# EAGLE schematic Schematic v28 (EAGLE 9.7.0)
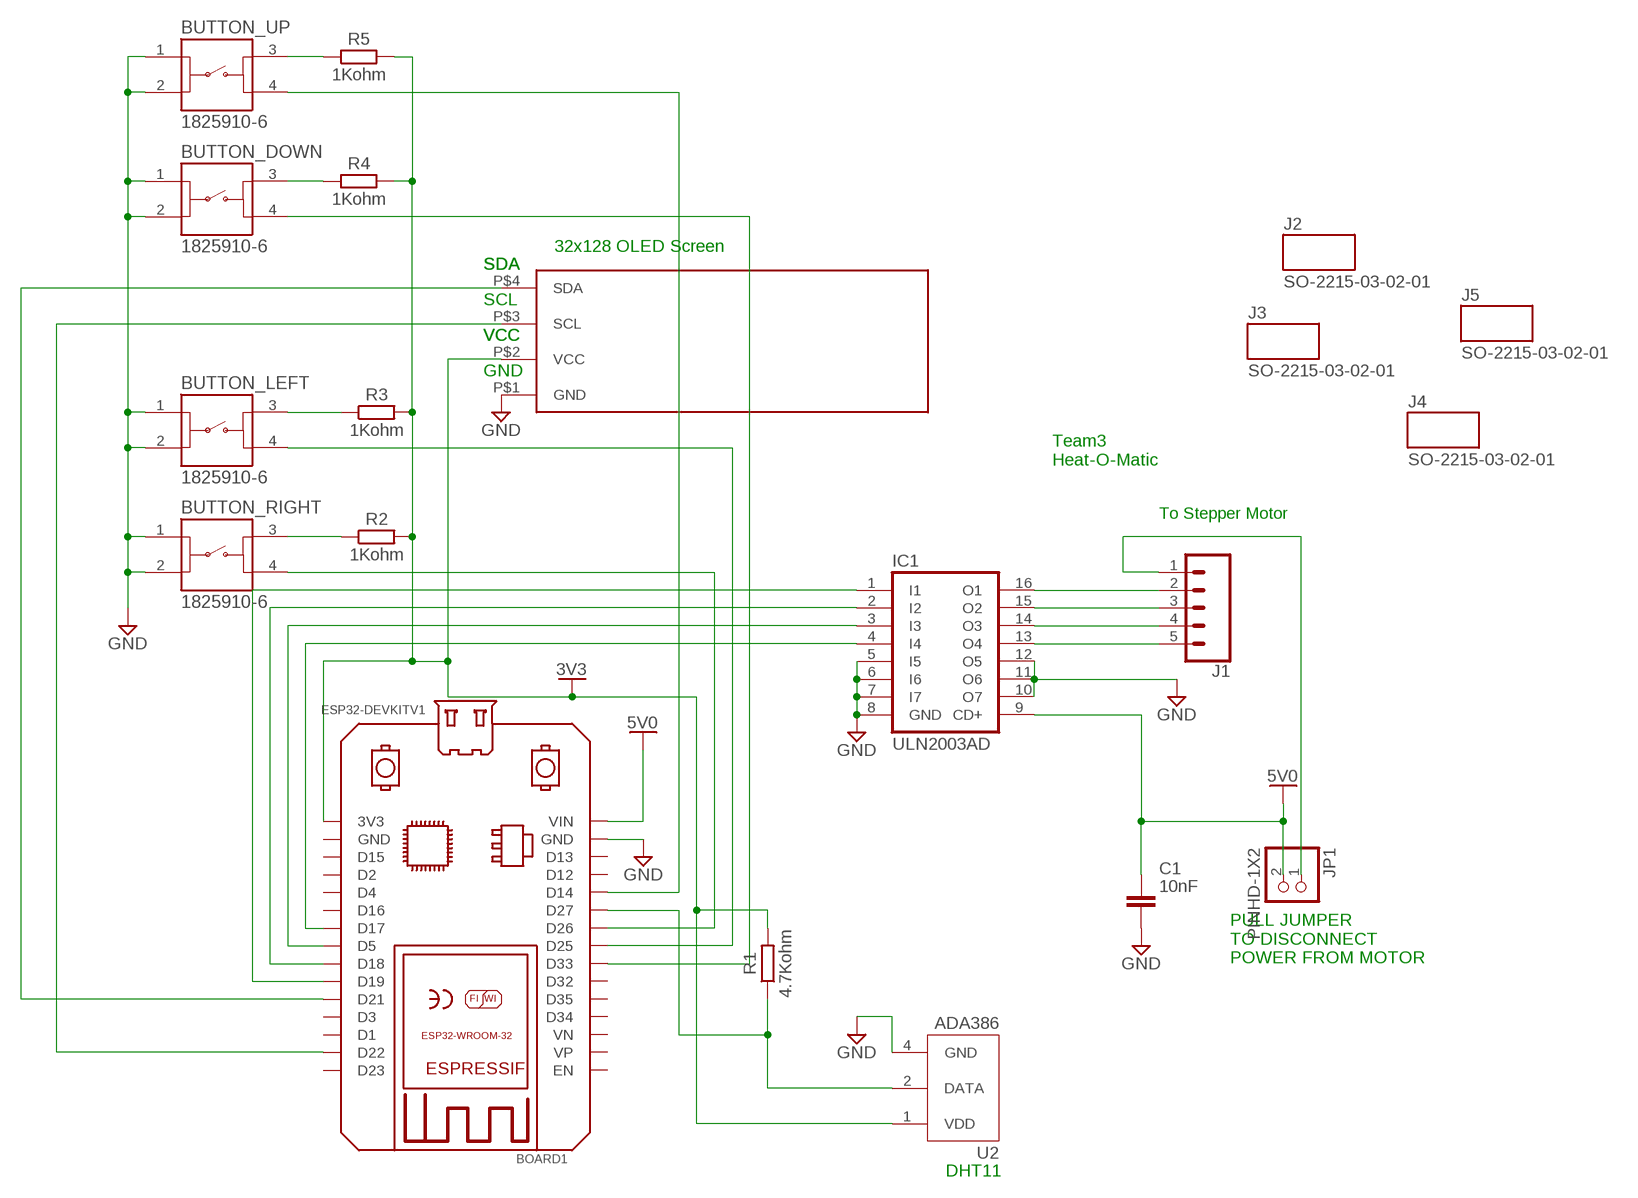
[diagram p0: schematic, sheet 1]

## Parts
32X128OLED_DISPLAY  32X128OLED  OLED  [SIP]
BOARD1  ESP32DEVKITV1  [ESP32-DEVKITV1]
BUTTON_DOWN  1825910-6  [1825910-6]
BUTTON_LEFT  1825910-6  [1825910-6]
BUTTON_RIGHT  1825910-6  [1825910-6]
BUTTON_UP  1825910-6  [1825910-6]
C1  10nF  C_CHIP-0805(2012-METRIC)  [CAPC2012X110]
IC1  ULN2003AD  [SO16]
J1  CONN_05JST-VERT  [JST-5-PTH-VERT]
J2  SO-2215-03-02-01  [SAMTEC_SO-2215-03-02-01]
J3  SO-2215-03-02-01  [SAMTEC_SO-2215-03-02-01]
J4  SO-2215-03-02-01  [SAMTEC_SO-2215-03-02-01]
J5  SO-2215-03-02-01  [SAMTEC_SO-2215-03-02-01]
JP1  PINHD-1X2  [1X02]
R1  4.7Kohm  R_CHIP-1206(3216-METRIC)  [RESC3216X70]
R2  1Kohm  R_CHIP-1206(3216-METRIC)  [RESC3216X70]
R3  1Kohm  R_CHIP-1206(3216-METRIC)  [RESC3216X70]
R4  1Kohm  R_CHIP-1206(3216-METRIC)  [RESC3216X70]
R5  1Kohm  R_CHIP-1206(3216-METRIC)  [RESC3216X70]
U2  ADA386  [XDCR_ADA386]

## Nets
3V3: 32X128OLED_DISPLAY.P$2(VCC) BOARD1.3V3 R1.2 R2.2 R3.2 R4.2 R5.2 U2.1(VDD)
5V0: BOARD1.VIN C1.1 IC1.9(CD+) JP1.2
GND: 32X128OLED_DISPLAY.P$1(GND) BOARD1.GND BUTTON_DOWN.1 BUTTON_DOWN.2 BUTTON_LEFT.1 BUTTON_LEFT.2 BUTTON_RIGHT.1 BUTTON_RIGHT.2 BUTTON_UP.1 BUTTON_UP.2 C1.2 IC1.5(I5) IC1.6(I6) IC1.7(I7) IC1.8(GND) IC1.10(O7) IC1.11(O6) IC1.12(O5) U2.4(GND)
N$1: BOARD1.D27 R1.1 U2.2(DATA)
N$2: 32X128OLED_DISPLAY.P$4(SDA) BOARD1.D21
N$3: BOARD1.D19 IC1.1(I1)
N$4: BOARD1.D18 IC1.2(I2)
N$5: BOARD1.D5 IC1.3(I3)
N$6: BOARD1.D17 IC1.4(I4)
N$7: IC1.16(O1) J1.2
N$8: BUTTON_UP.3 R5.1
N$9: IC1.14(O3) J1.4
N$10: IC1.13(O4) J1.5
N$11: J1.1 JP1.1
N$12: IC1.15(O2) J1.3
N$13: BUTTON_DOWN.3 R4.1
N$14: BOARD1.D33 BUTTON_DOWN.4
N$15: BOARD1.D14 BUTTON_UP.4
N$16: BUTTON_RIGHT.3 R2.1
N$17: 32X128OLED_DISPLAY.P$3(SCL) BOARD1.D22
N$18: BOARD1.D26 BUTTON_RIGHT.4
N$19: BOARD1.D25 BUTTON_LEFT.4
N$20: BUTTON_LEFT.3 R3.1
Unconnected: BOARD1.D1 BOARD1.D2 BOARD1.D3 BOARD1.D4 BOARD1.D12 BOARD1.D13 BOARD1.D15 BOARD1.D16 BOARD1.D23 BOARD1.D32 BOARD1.D34 BOARD1.D35 BOARD1.EN BOARD1.GND@1(GND) BOARD1.VN BOARD1.VP

## Notes on the sheet
- 32x128 OLED Screen
- SDA | SDA
- SCL
- VCC | VCC
- GND
- Team3
  Heat-O-Matic
- To Stepper Motor
- PULL JUMPER 
  TO DISCONNECT
  POWER FROM MOTOR
- DHT11

## Library data of the parts
32X128OLED_DISPLAY = OLED:OLED: I2C 0.91"128x32 OLED
BOARD1 = ESP32-DEVKITV1:ESP32DEVKITV1: https://github.com/shridattdudhat
BUTTON_DOWN BUTTON_LEFT BUTTON_RIGHT BUTTON_UP = Switch:1825910-6: SWITCH TACTILE SPST-NO 0.05A 24V Manufacturer's datasheet <https://www.te.com/commerce/DocumentDelivery/DDEController?Action=srchrtrv&DocNm=1825910&DocType=Customer+Drawing&DocLang=English>; CREATED_BY: PCBLayout.com; DIGIKEY_PART_NUMBER: 450-1650-ND; MANUFACTURER: TE Connectivity ALCOSWITCH Switches; MPN: 1825910-6
C1 = Capacitor:C: Capacitor - Generic; CATEGORY: Capacitor
IC1 = uln-udn:ULN2003A: DRIVER ARRAY
J1 = SparkFun-Connectors:CONN_05: Multi connection point. Often used as Generic Header-pin footprint for 0.1 inch spaced/style header connections On any of the 0.1 inch spaced packages, you can populate with these: Break Away Headers - Straight <https://www.sparkfun.com/products/116> (PRT-00116) Break Away Male Headers - Right Angle <https://www.sparkfun.com/products/553> (PRT-00553) Female Headers <https://www.sparkfun.com/products/115> (PRT-00115) Break Away Headers - Machine Pin <https://www.sparkfun.com/products/117> (PRT-00117) Break Away Female Headers - Swiss Machine Pin <https://www.sparkfun.com/products/743> (PRT-00743) For SCREWTERMINALS and SPRING TERMINALS visit here: Screw Terimnals on SparkFun.com <https://www.sparkfun.com/search/results?term=Screw+Terminals> (5mm/3.5mm/2.54mm spacing) This device is also useful as a general connection point to wire up your design to another part of your project. Our various solder wires solder well into these plated through hole pads. Hook-Up Wire - Assortment (Stranded, 22 AWG) <https://www.sparkfun.com/products/11375> (PRT-11375) Hook-Up Wire - Assortment (Solid Core, 22 AWG) <https://www.sparkfun.com/products/11367> (PRT-11367) View the entire wire category on our website here <https://www.sparkfun.com/categories/141> Special notes: Molex polarized connector foot print use with SKU : PRT-08231 with associated crimp pins and housings. 1MM SMD Version SKU: PRT-10208
J2-J5 = SO-2215-03-02-01:SO-2215-03-02-01: SO Series Precision Board Stacking Standoff; MANUFACTURER: Samtec; MAXIMUM_PACKAGE_HEIGHT: 22.15 mm; PARTREV: AX; STANDARD: Manufacturer Recommendations
JP1 = Connector:PINHD-1X2: PIN HEADER; CATEGORY: CONNECTOR; SUB-CATEGORY: PIN-HEADER
R1-R5 = Resistor:R: Resistor Fixed - Generic; CATEGORY: Resistor; SUB-CATEGORY: Fixed
U2 = ADA386:ADA386: DHT11 basic temperature-humidity sensor + extras; MANUFACTURER: Adafruit; MAXIMUM_PACKAGE_HEIGHT: 15.5mm; PARTREV: N/A; STANDARD: Manufacturer Recommendations